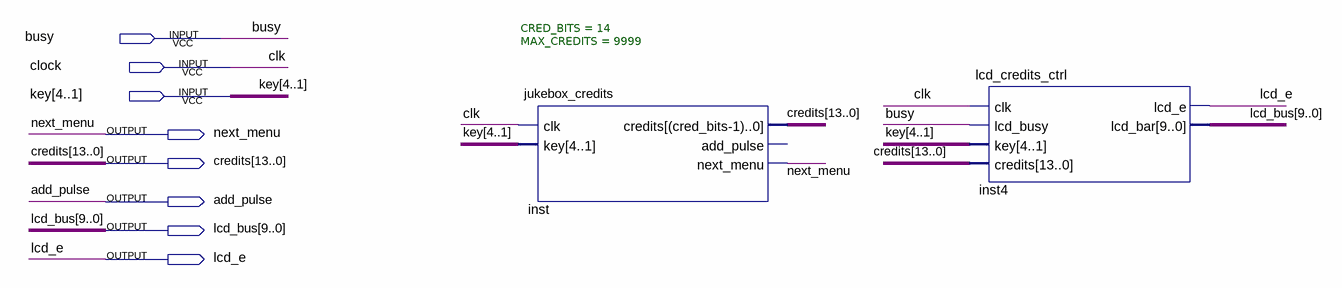
[diagram p0: schematic sheet]
// Quartus schematic credit_manager.bdf as structural Verilog: 2 symbols, 8 pins
module credit_manager (
  input  busy,
  input  clock,
  input  [4:1] key,
  output next_menu,
  output [13:0] credits,
  output add_pulse,
  output [9:0] lcd_bus,
  output lcd_e
);

  jukebox_credits #(.CRED_BITS(14), .MAX_CREDITS(9999)) inst (
    .clk(clock), .key(key), .credits(credits), .next_menu(next_menu));  // open: add_pulse
  lcd_credits_ctrl inst4 (.clk(clock), .lcd_busy(busy), .key(key), .credits(credits), .lcd_e(lcd_e), .lcd_bar(lcd_bus));

  // Other names for the same wires on the sheet: clk = clock
endmodule
